# Altium schematic sheet connector.SchDoc: Ethenet Module
size A3; CompanyName: ETH Zurich, University of Bologna; DrawnBy: Mattia Sinigaglia; Organization: IIS; DocumentNumber: 2; Revision: 0.1; SheetNumber: 3; SheetTotal: 3
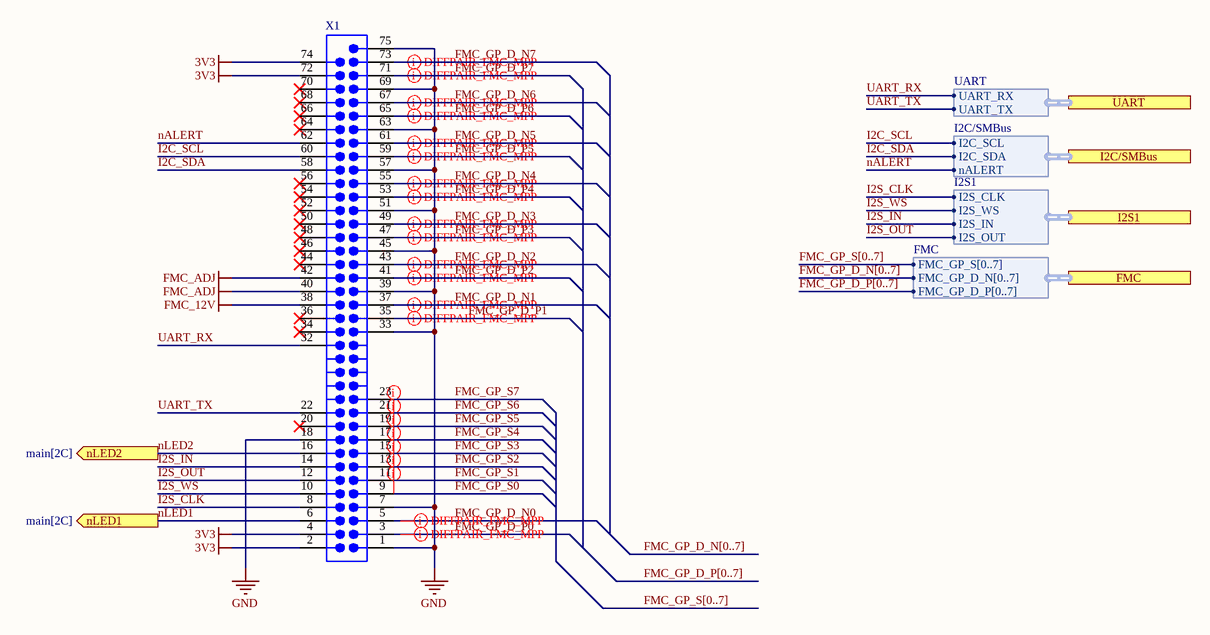
[diagram p0: connector.SchDoc]

## Parts
X1  CONN PWR CARD EDGE PCB SLOT MALE  [CON-67_0.5MM_PCB_SLOT]  (value not drawn)  (no BOM)

## Ports
FMC (harness FMC, see main[2B], Ethernet[2D]), I2C/SMBus (harness I2C/SMBus, see main[2B]), I2S1 (harness I2S1, see main[2B]), nLED1 (out, see main[2C]), nLED2 (out, see main[2C]), UART (harness UART, see main[2B])

## Harnesses
I2C/SMBus: I2C_SDA, I2C_SCL, nALERT
UART: UART_TX, UART_RX
I2S1: I2S_OUT, I2S_IN, I2S_WS, I2S_CLK
FMC: FMC_GP_D_N[0..7], FMC_GP_S[0..7], FMC_GP_D_P[0..7]

## Nets
3V3: X1.2 X1.4 X1.72 X1.74
FMC_12V: X1.38
FMC_ADJ: X1.40 X1.42
GND: X1.1 X1.7 X1.18 X1.33 X1.39 X1.45 X1.51 X1.57 X1.63 X1.69 X1.75
FMC_GP_D_N0: X1.5
FMC_GP_D_N1: X1.37
FMC_GP_D_N2: X1.43
FMC_GP_D_N3: X1.49
FMC_GP_D_N4: X1.55
FMC_GP_D_N5: X1.61
FMC_GP_D_N6: X1.67
FMC_GP_D_N7: X1.73
FMC_GP_D_P0: X1.3
FMC_GP_D_P1: X1.35
FMC_GP_D_P2: X1.41
FMC_GP_D_P3: X1.47
FMC_GP_D_P4: X1.53
FMC_GP_D_P5: X1.59
FMC_GP_D_P6: X1.65
FMC_GP_D_P7: X1.71
FMC_GP_S0: X1.9
FMC_GP_S1: X1.11
FMC_GP_S2: X1.13
FMC_GP_S3: X1.15
FMC_GP_S4: X1.17
FMC_GP_S5: X1.19
FMC_GP_S6: X1.21
FMC_GP_S7: X1.23
I2C_SCL: X1.60 ; port I2C/SMBus.I2C_SCL
I2C_SDA: X1.58 ; port I2C/SMBus.I2C_SDA
I2S_CLK: X1.8 ; port I2S1.I2S_CLK
I2S_IN: X1.14 ; port I2S1.I2S_IN
I2S_OUT: X1.12 ; port I2S1.I2S_OUT
I2S_WS: X1.10 ; port I2S1.I2S_WS
nALERT: X1.62 ; port I2C/SMBus.nALERT
nLED1: X1.6 ; port nLED1
nLED2: X1.16 ; port nLED2
UART_RX: X1.32 ; port UART.UART_RX
UART_TX: X1.22 ; port UART.UART_TX

Not connected (* = marked no-connect by the designer): X1 20* 34* 36* 44* 46* 48* 50* 52(51)* 54(52)* 56(53)* 64* 66* 68* 70*

## Buses and harness runs
bus FMC_GP_D_N[0..7]
bus FMC_GP_D_P[0..7]
bus FMC_GP_S[0..7]

## Layout directives
differential pair; net class DP_GP; differential pair class DP_100R: FMC_GP_D_N0, FMC_GP_D_N1, FMC_GP_D_N2, FMC_GP_D_N3, FMC_GP_D_N4, FMC_GP_D_N5, FMC_GP_D_N6, FMC_GP_D_N7, FMC_GP_D_P0, FMC_GP_D_P1, FMC_GP_D_P2, FMC_GP_D_P3, FMC_GP_D_P4, FMC_GP_D_P5, FMC_GP_D_P6, FMC_GP_D_P7
net class S_GP; net class SE_50R: FMC_GP_S0, FMC_GP_S1, FMC_GP_S2, FMC_GP_S3, FMC_GP_S4, FMC_GP_S5, FMC_GP_S6

## Notes on the sheet
- 1
- 2
- 3
- 4
- 5
- 6
- 7
- 8
- A
- B
- C
- D
- Project:
- Date:
- Drawing number:
- Rev:
- Format:
- A3
- Drawn by:
- Laboratory:
- Page
- Sheet:
- of
- File:

## Library data of the parts
X1 = CMP-01224-1: Mates with 2199119-4 - No BOM; Number of Positions: 67; Pitch: 0.5mm; Card Thickness: 0.8mm; Card Type: Non Specified - Dual Edge; Gender: Male; Mates with: 2199119-4